# Altium schematic sheet Sheet1.SchDoc
size A1
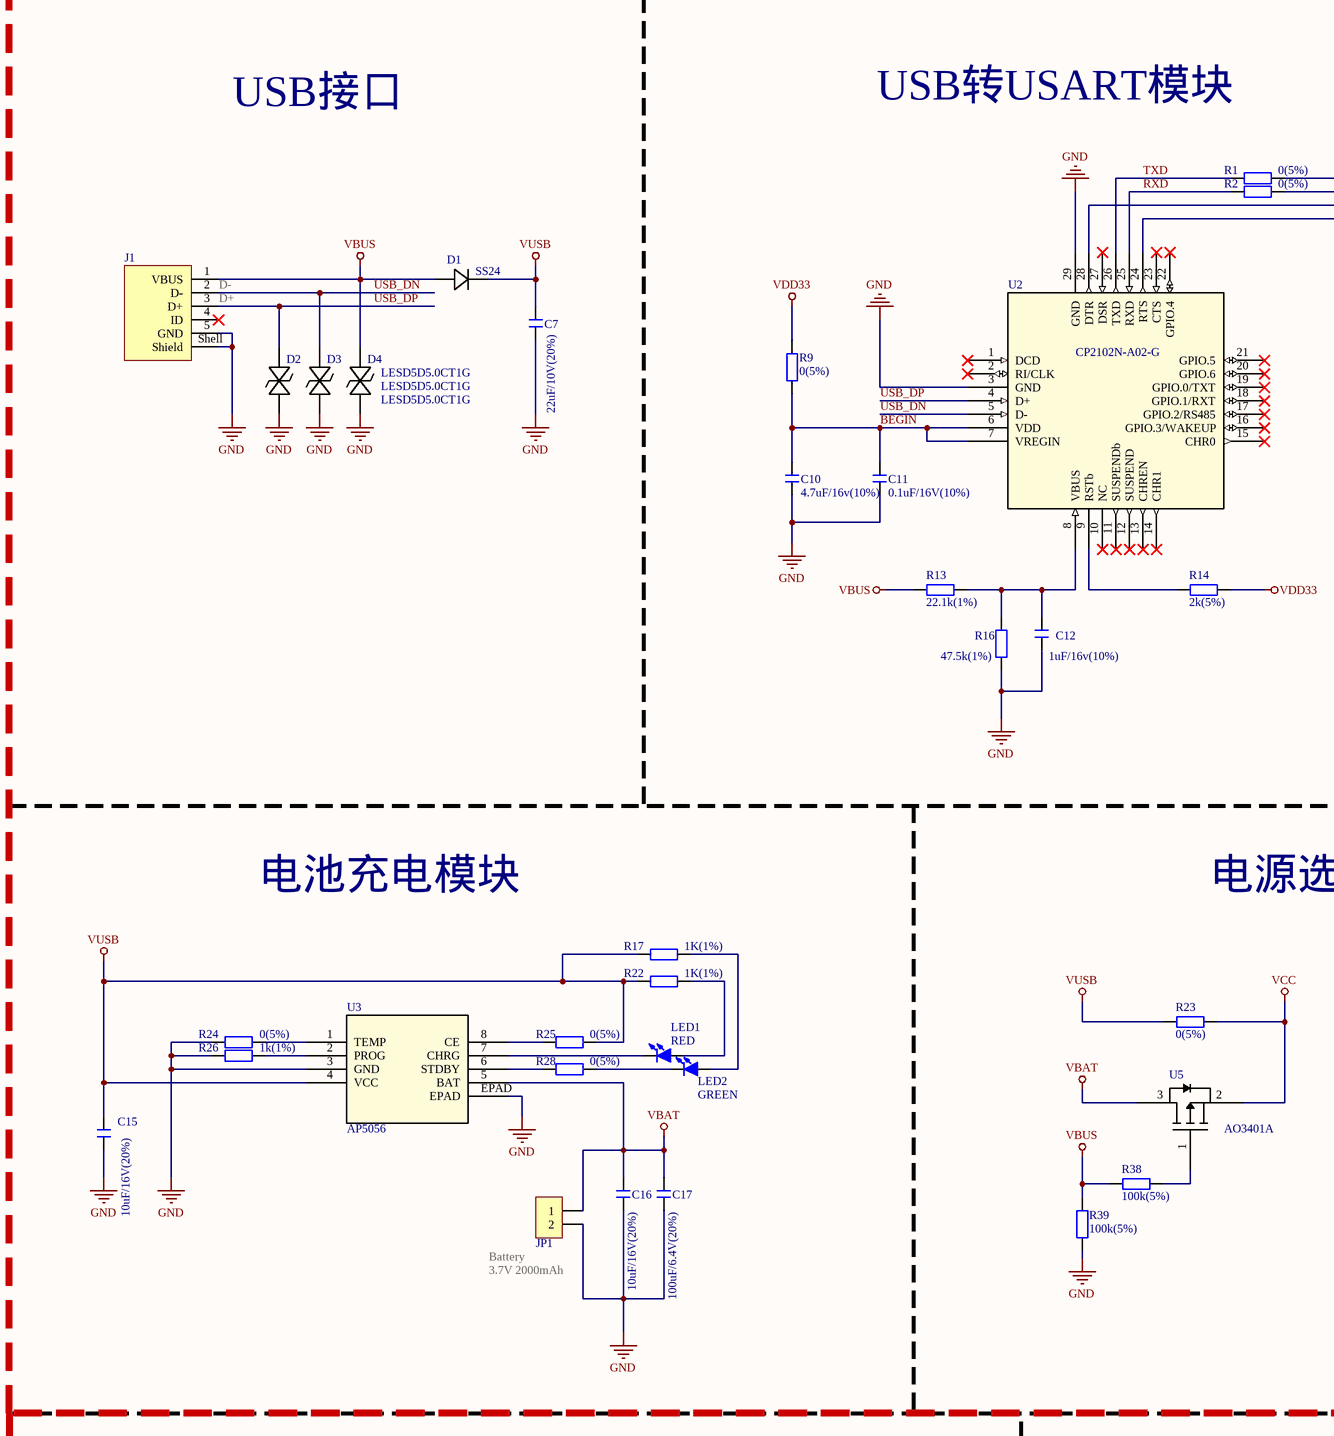
[diagram p0: Sheet1.SchDoc, top left]
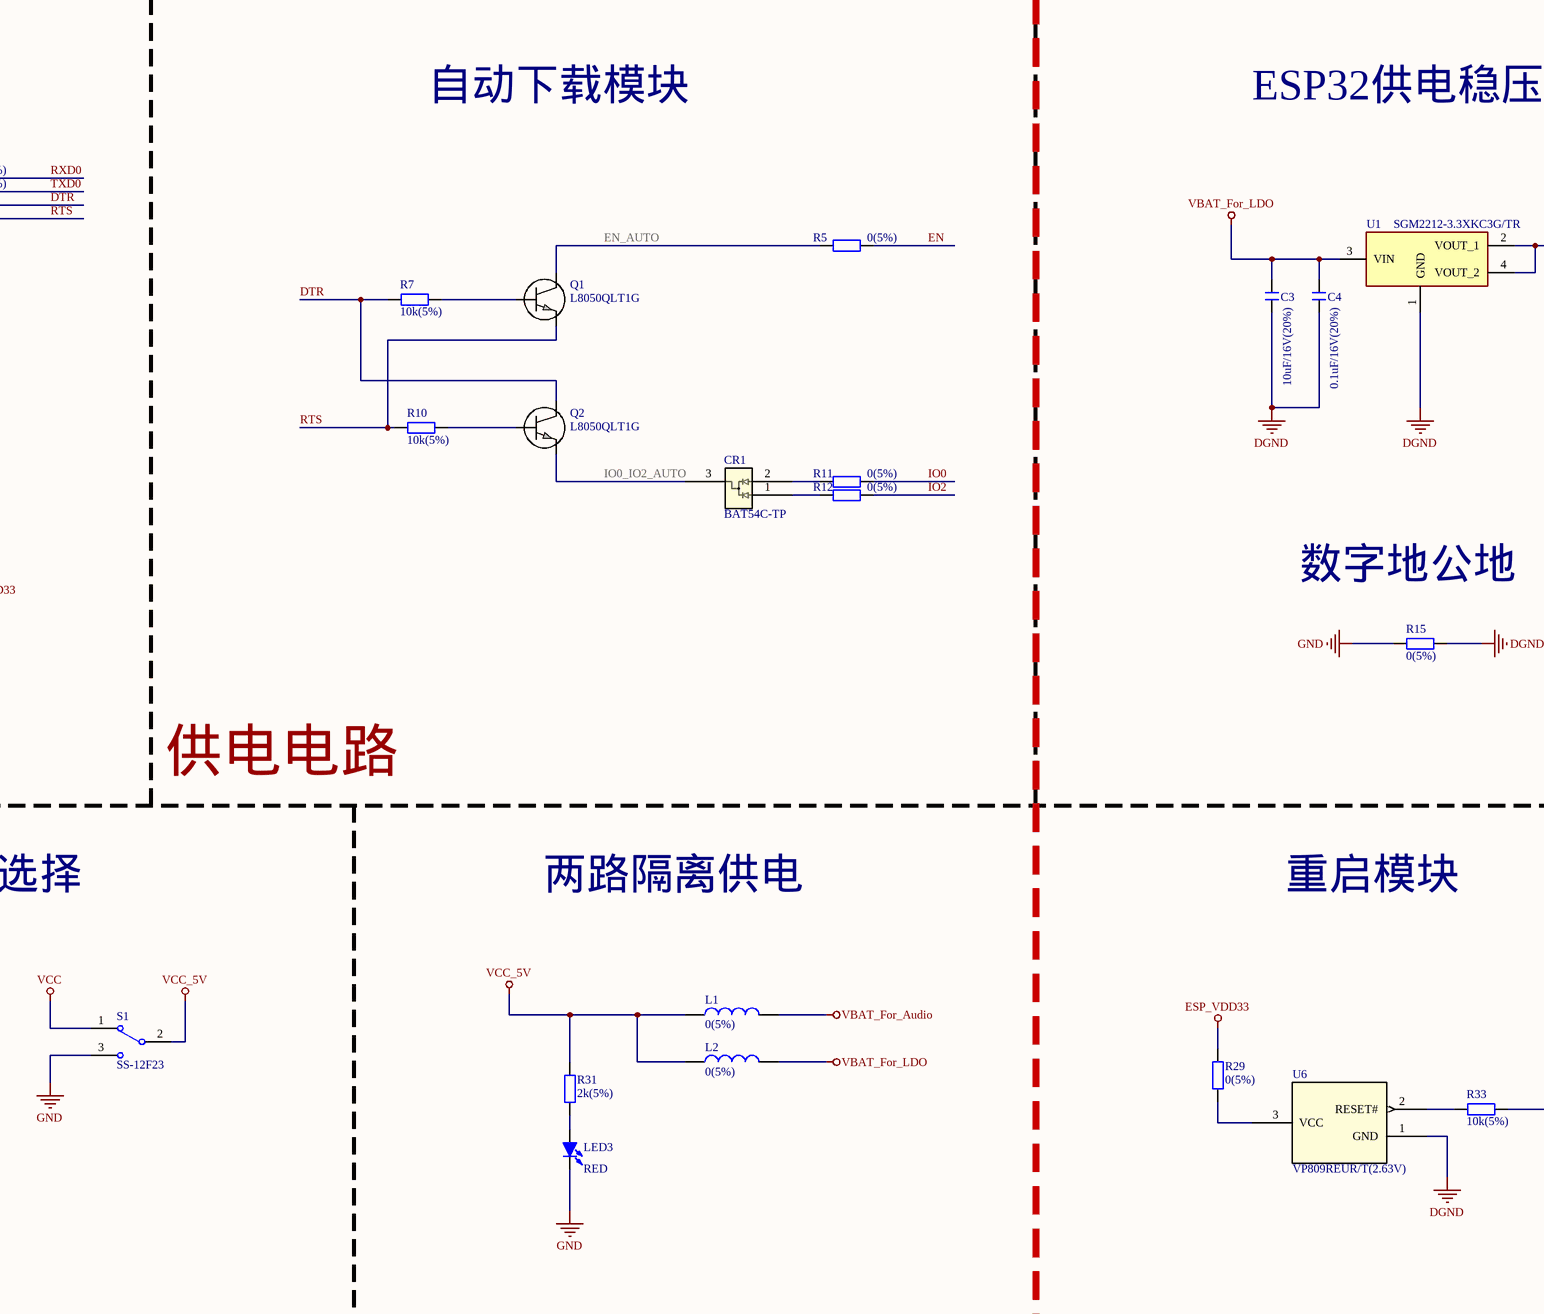
[diagram p1: Sheet1.SchDoc, top middle]
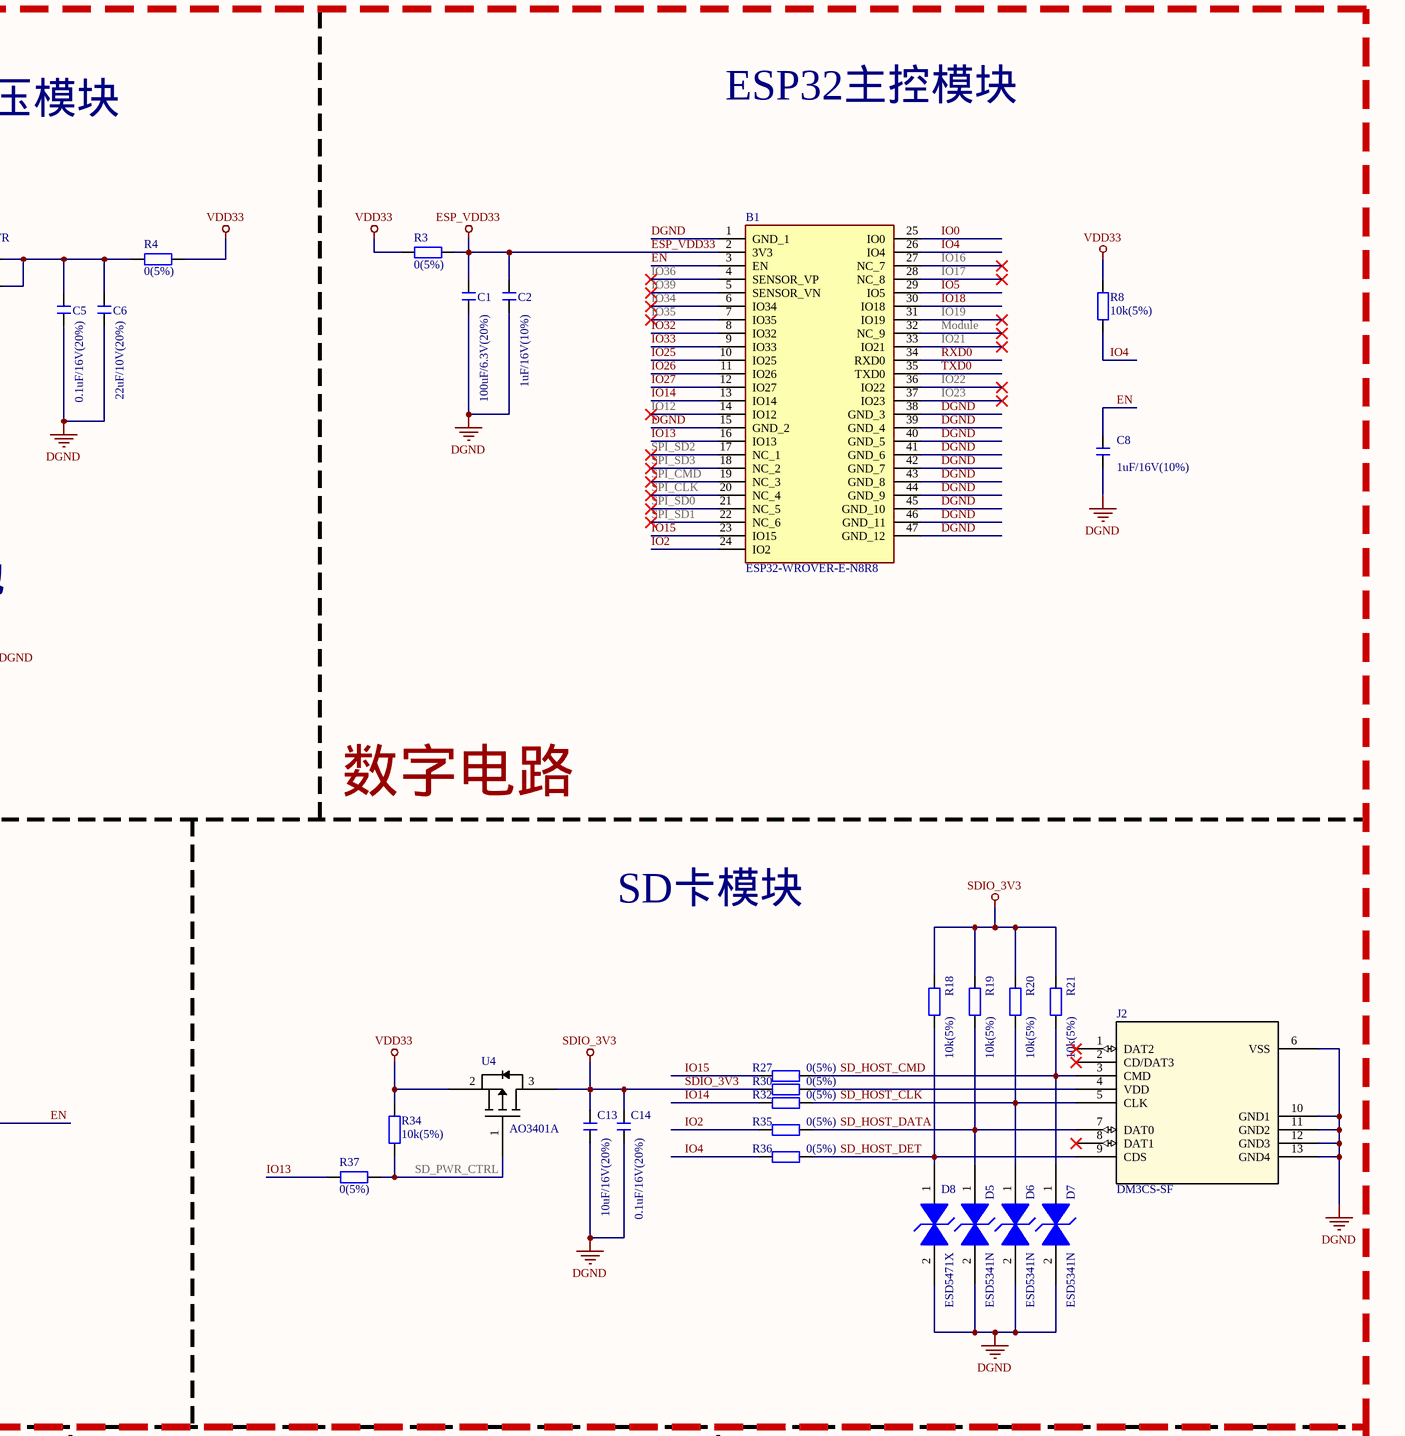
[diagram p2: Sheet1.SchDoc, top right]
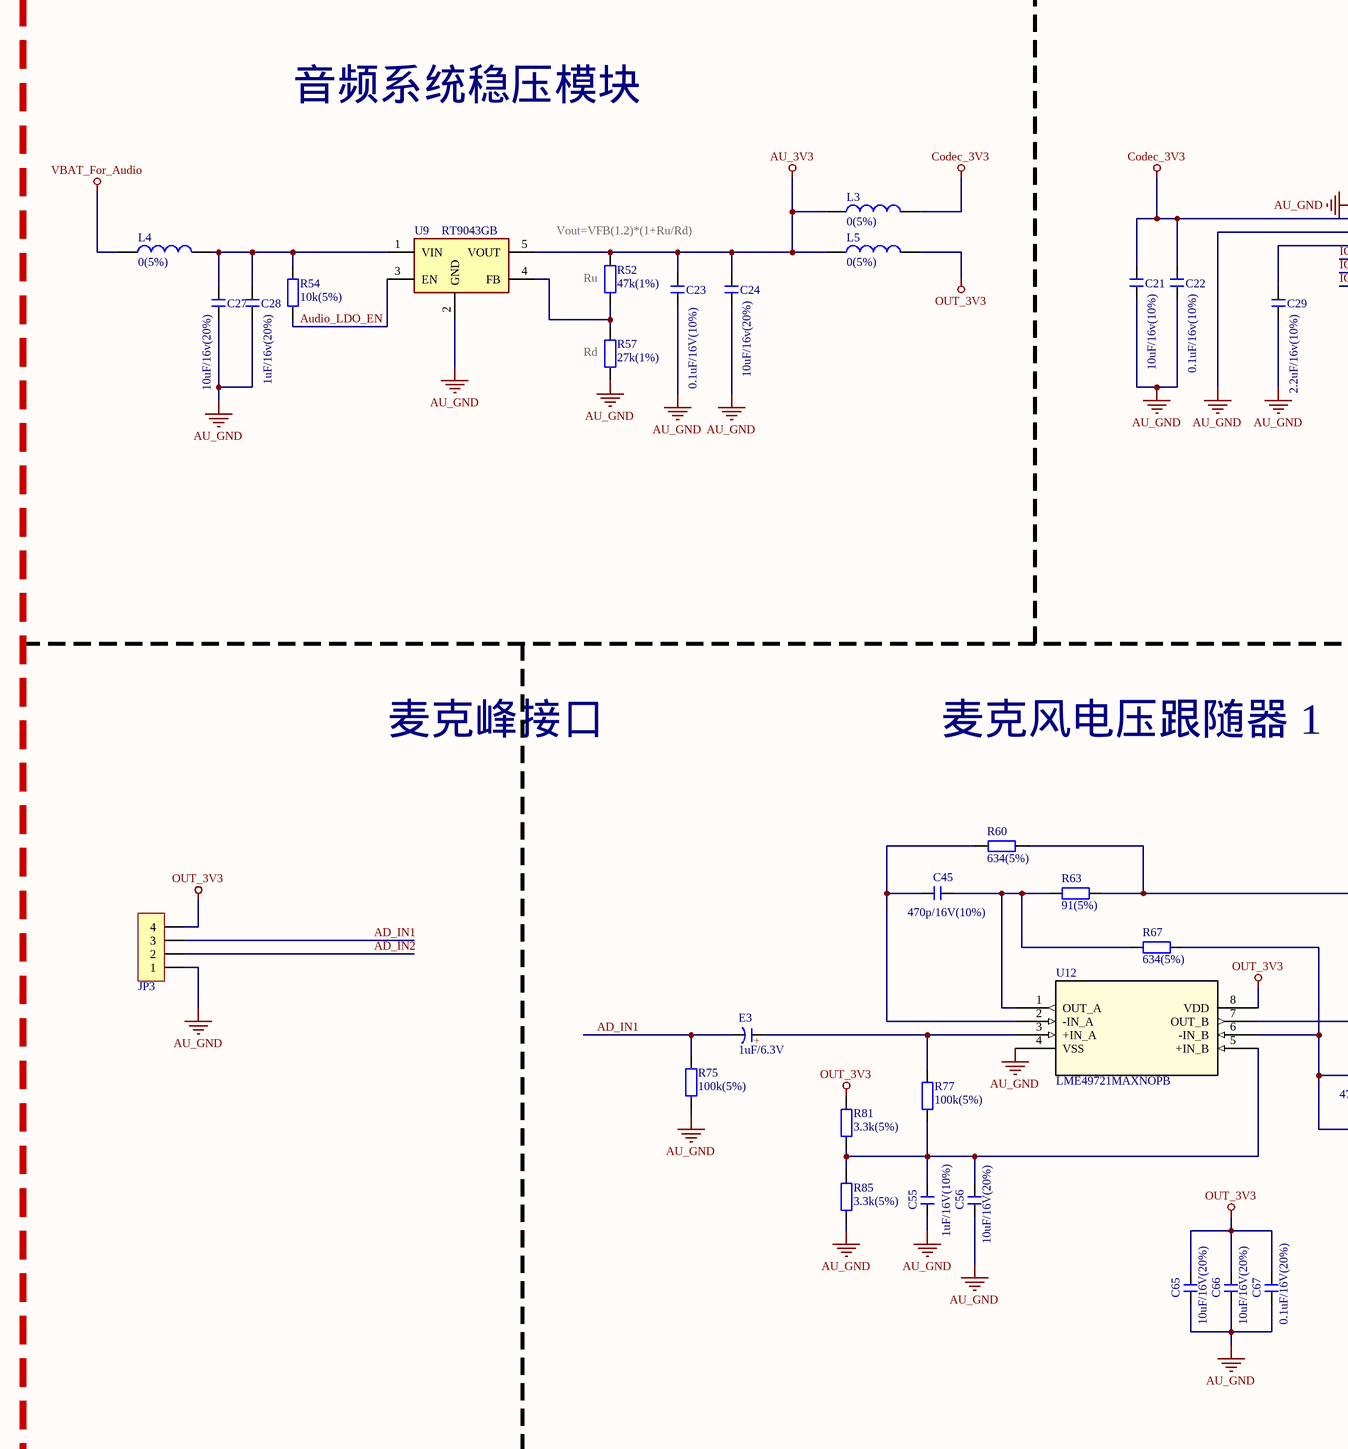
[diagram p3: Sheet1.SchDoc, bottom left]
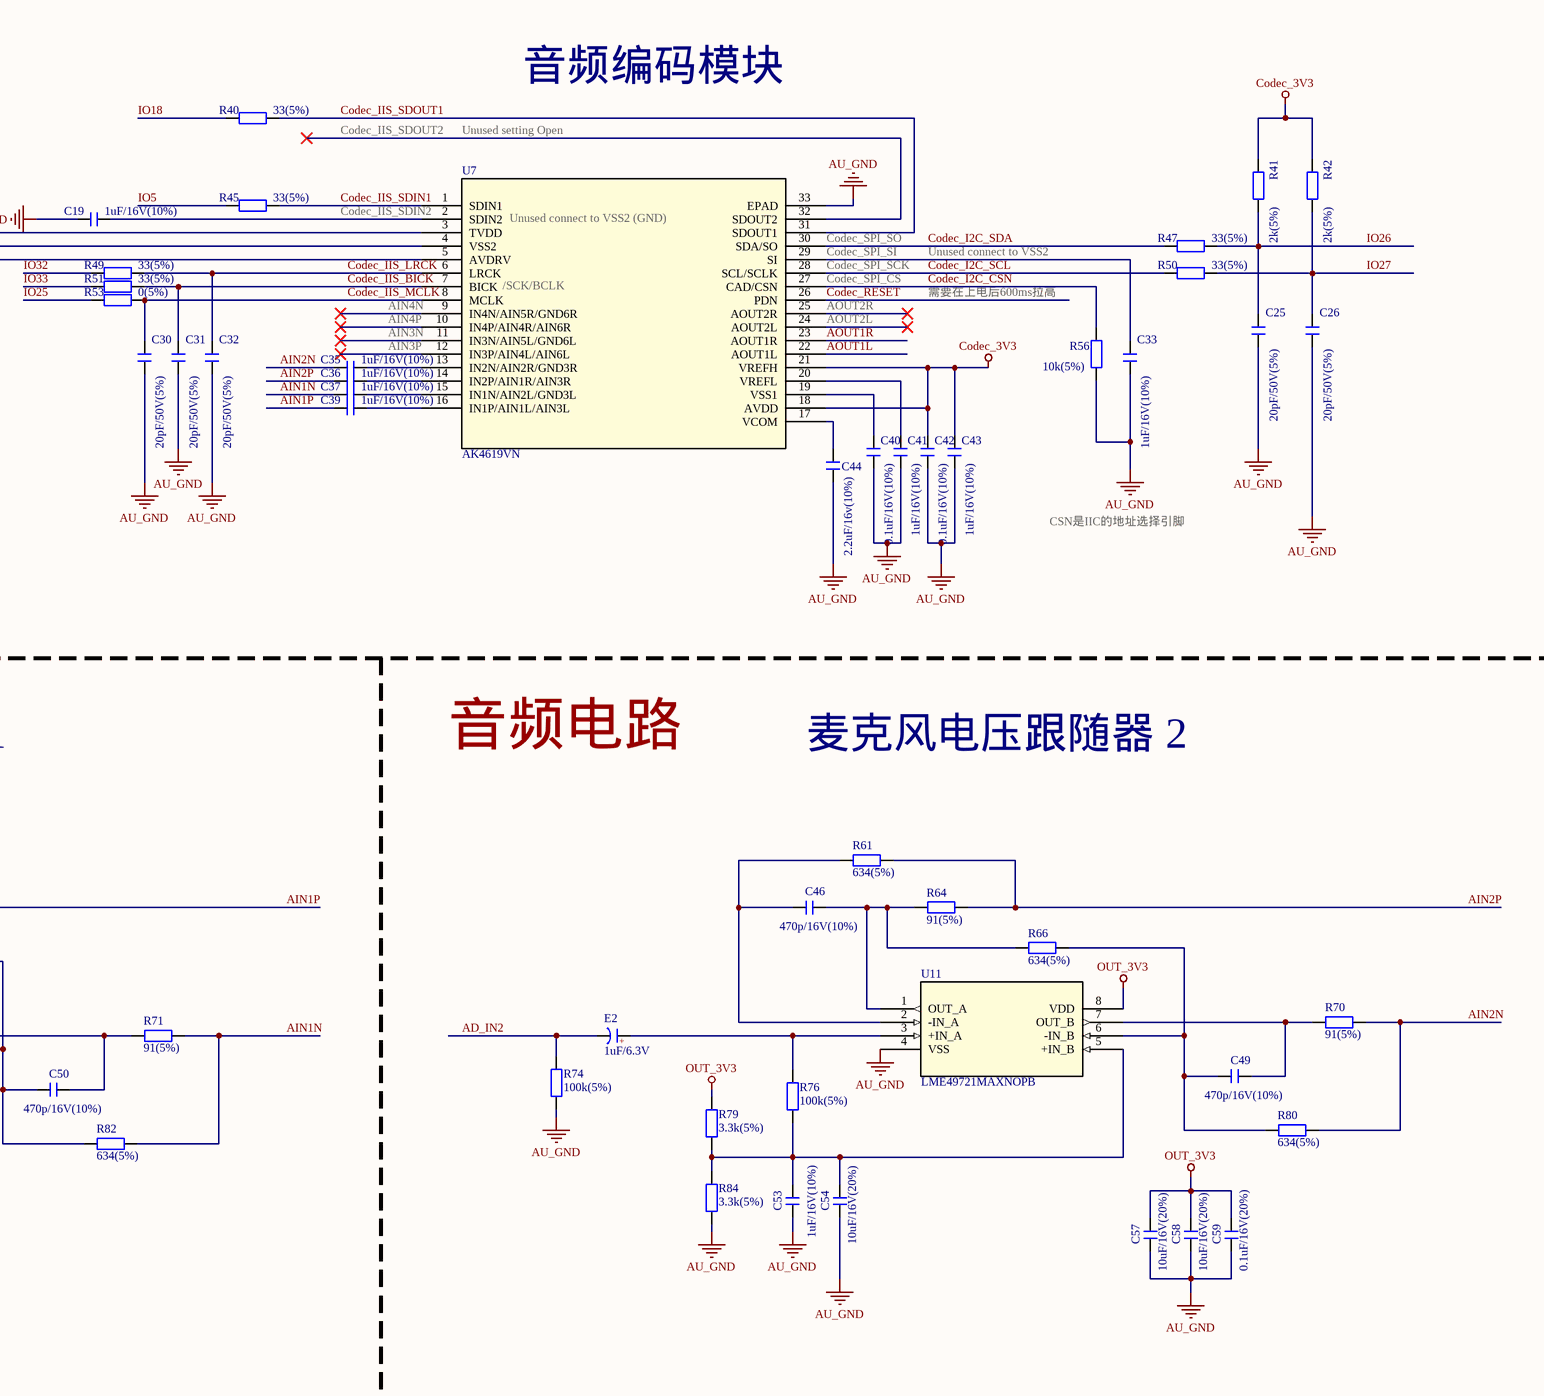
[diagram p4: Sheet1.SchDoc, bottom middle]
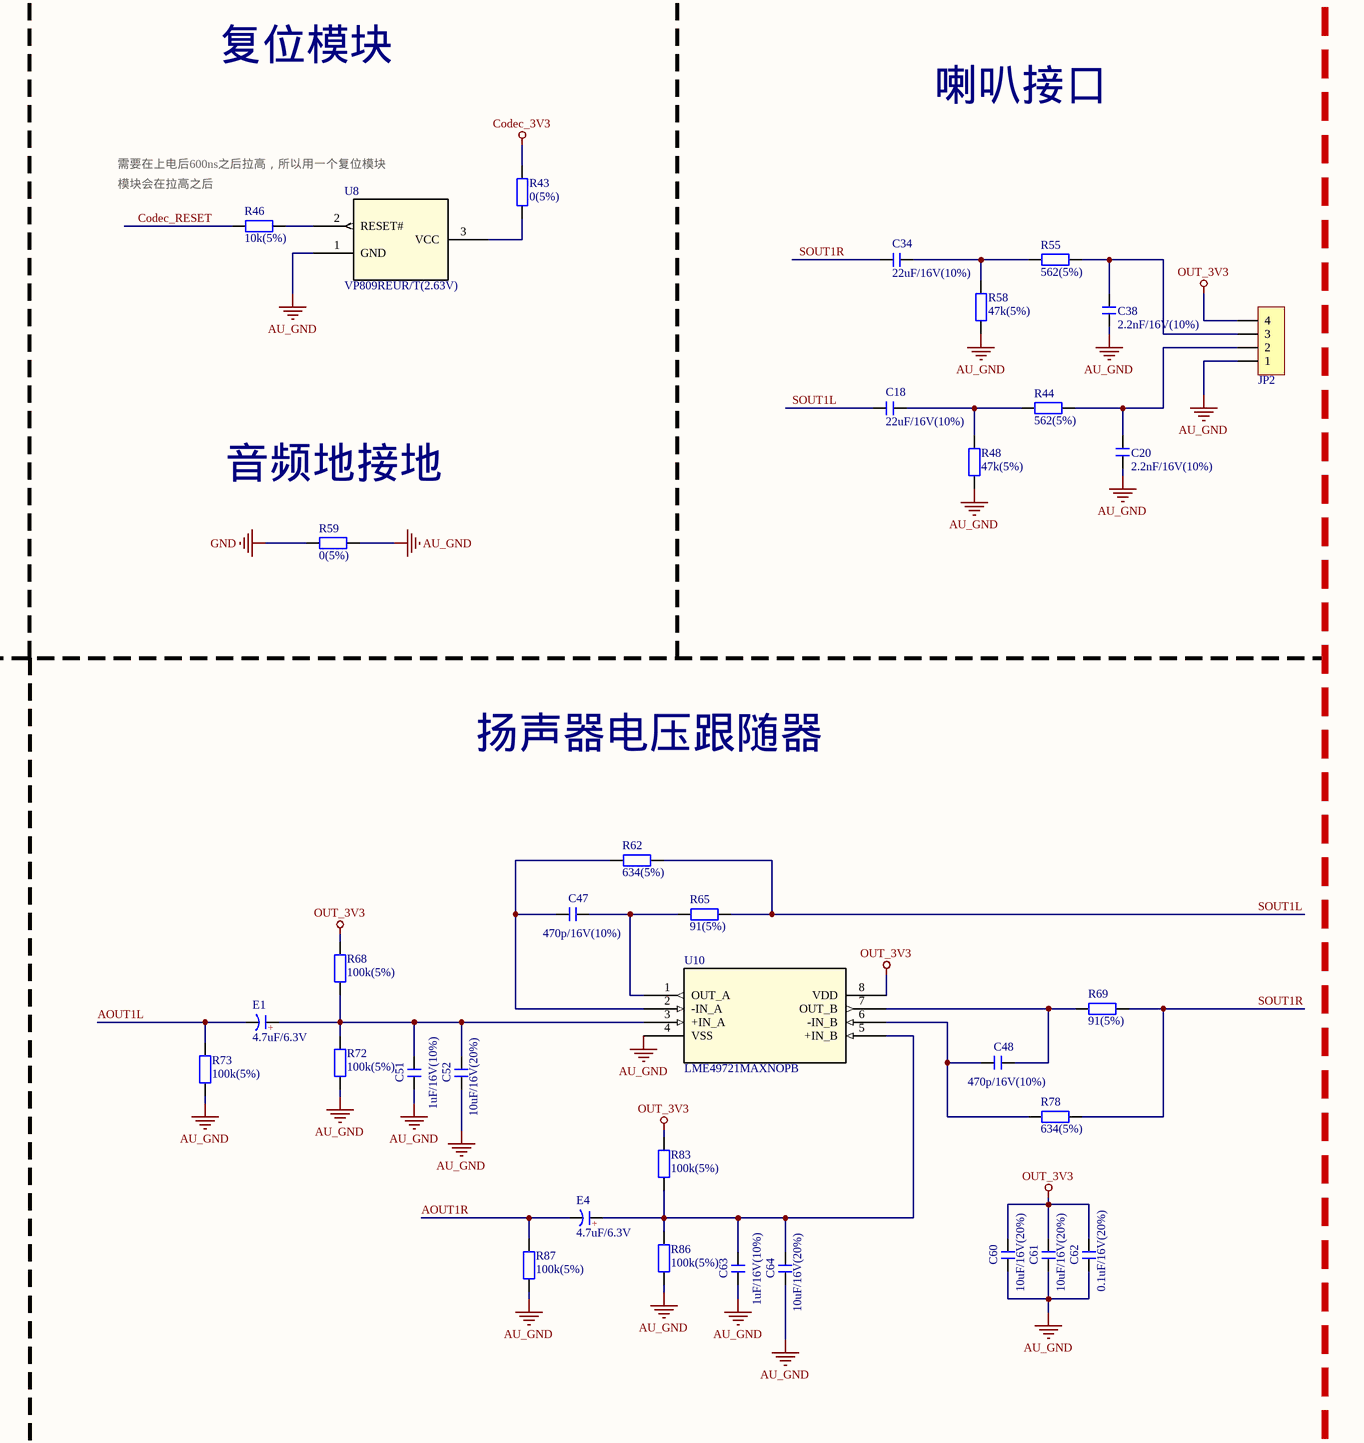
[diagram p5: Sheet1.SchDoc, bottom right]

## Parts
B1  ESP32-WROVER-E-N8R8  [ESP32WROVEREN8R8]
C1  100uF/6.3V(20%)  [C 1206]
C2  1uF/16V(10%)  [C 0402]
C3  10uF/16V(20%)  [C 0603]
C4  0.1uF/16V(20%)  [C 0402]
C5  0.1uF/16V(20%)  [C 0603]
C6  22uF/10V(20%)  [C 0805]
C7  22uF/10V(20%)  [C 0603]
C8  1uF/16V(10%)  [C 0402]
C10  4.7uF/16v(10%)  [C 0603]
C11  0.1uF/16V(10%)  [C 0402]
C12  1uF/16v(10%)  [C 0402]
C13  10uF/16V(20%)  [C 0603]
C14  0.1uF/16V(20%)  [C 0402]
C15  10uF/16V(20%)  [C 0603]
C16  10uF/16V(20%)  [C 0603]
C17  100uF/6.4V(20%)  [C 1206]
C18  22uF/16V(10%)  [C 0603]
C19  1uF/16V(10%)  [C 0402]
C20  2.2nF/16V(10%)  [C 0603]
C21  10uF/16v(10%)  [C 0603]
C22  0.1uF/16v(10%)  [C 0402]
C23  0.1uF/16V(10%)  [C 0402]
C24  10uF/16v(20%)  [C 0603]
C25  20pF/50V(5%)  [C 0402]
C26  20pF/50V(5%)  [C 0402]
C27  10uF/16v(20%)  [C 0603]
C28  1uF/16v(20%)  [C 0402]
C29  2.2uF/16v(10%)  [C 0603]
C30  20pF/50V(5%)  [C 0402]
C31  20pF/50V(5%)  [C 0402]
C32  20pF/50V(5%)  [C 0402]
C33  1uF/16V(10%)  [C 0402]
C34  22uF/16V(10%)  [C 0603]
C35  1uF/16V(10%)  [C 0402]
C36  1uF/16V(10%)  [C 0402]
C37  1uF/16V(10%)  [C 0402]
C38  2.2nF/16V(10%)  [C 0603]
C39  1uF/16V(10%)  [C 0402]
C40  0.1uF/16V(10%)  [C 0402]
C41  1uF/16V(10%)  [C 0402]
C42  0.1uF/16V(10%)  [C 0402]
C43  1uF/16V(10%)  [C 0402]
C44  2.2uF/16v(10%)  [C 0603]
C45  470p/16V(10%)  [C 0603]
C46  470p/16V(10%)  [C 0603]
C47  470p/16V(10%)  [C 0603]
C48  470p/16V(10%)  [C 0603]
C49  470p/16V(10%)  [C 0603]
C50  470p/16V(10%)  [C 0603]
C51  1uF/16V(10%)  [C 0603]
C52  10uF/16V(20%)  [C 0603]
C53  1uF/16V(10%)  [C 0603]
C54  10uF/16V(20%)  [C 0603]
C55  1uF/16V(10%)  [C 0603]
C56  10uF/16V(20%)  [C 0603]
C57  10uF/16V(20%)  [C 0603]
C58  10uF/16V(20%)  [C 0603]
C59  0.1uF/16V(20%)  [C 0603]
C60  10uF/16V(20%)  [C 0603]
C61  10uF/16V(20%)  [C 0603]
C62  0.1uF/16V(20%)  [C 0603]
C63  1uF/16V(10%)  [C 0603]
C64  10uF/16V(20%)  [C 0603]
C65  10uF/16V(20%)  [C 0603]
C66  10uF/16V(20%)  [C 0603]
C67  0.1uF/16V(20%)  [C 0603]
CR1  BAT54C-TP  [BAT54C-TP_MCE]
D1  SS24  [DIODE_DO214AA]
D2  LESD5D5.0CT1G  [CR_5.0CT1G_UMW]
D3  LESD5D5.0CT1G  [CR_5.0CT1G_UMW]
D4  LESD5D5.0CT1G  [CR_5.0CT1G_UMW]
D5  ESD5341N  [DFN1006-2_0402_TCP]
D6  ESD5341N  [DFN1006-2_0402_TCP]
D7  ESD5341N  [DFN1006-2_0402_TCP]
D8  ESD5471X  [DFN1006-2_0402_TCP]
E1  4.7uF/6.3V  [CD A(3216)]
E2  1uF/6.3V  [CD A(3216)]
E3  1uF/6.3V  [CD A(3216)]
E4  4.7uF/6.3V  [CD A(3216)]
J1  629105150521  [629105150521]  (value not drawn)
J2  DM3CS-SF  [DM3CS-SF_HIR]
JP1  HDR-1X2  [HDR-1X2]  (value not drawn)
JP2  HDR-1X4  [KF128-3.81-4P]  (value not drawn)
JP3  HDR-1X4  [KF128-3.81-4P]  (value not drawn)
L1  0(5%)  [L 0603]
L2  0(5%)  [L 0603]
L3  0(5%)  [L 0603]
L4  0(5%)  [L 0603]
L5  0(5%)  [L 0603]
LED1  RED  [LED 0603R]
LED2  GREEN  [LED 0603G]
LED3  RED  [LED 0603R]
Q1  L8050QLT1G  [SOT-23_LRC]
Q2  L8050QLT1G  [SOT-23_LRC]
R1  0(5%)  [R 0402]
R2  0(5%)  [R 0402]
R3  0(5%)  [R 0603]
R4  0(5%)  [R 0603]
R5  0(5%)  [R 0402]
R7  10k(5%)  [R 0402]
R8  10k(5%)  [R 0402]
R9  0(5%)  [R 0603]
R10  10k(5%)  [R 0402]
R11  0(5%)  [R 0402]
R12  0(5%)  [R 0402]
R13  22.1k(1%)  [R 0402]
R14  2k(5%)  [R 0402]
R15  0(5%)  [R 0805]
R16  47.5k(1%)  [R 0402]
R17  1K(1%)  [R 0402]
R18  10k(5%)  [R 0402]
R19  10k(5%)  [R 0402]
R20  10k(5%)  [R 0402]
R21  10k(5%)  [R 0402]
R22  1K(1%)  [R 0402]
R23  0(5%)  [R 0603]
R24  0(5%)  [R 0402]
R25  0(5%)  [R 0402]
R26  1k(1%)  [R 0402]
R27  0(5%)  [R 0402]
R28  0(5%)  [R 0402]
R29  0(5%)  [R 0402]
R30  0(5%)  [R 0402]
R31  2k(5%)  [R 0402]
R32  0(5%)  [R 0402]
R33  10k(5%)  [R 0402]
R34  10k(5%)  [R 0402]
R35  0(5%)  [R 0402]
R36  0(5%)  [R 0402]
R37  0(5%)  [R 0402]
R38  100k(5%)  [R 0402]
R39  100k(5%)  [R 0402]
R40  33(5%)  [R 0402]
R41  2k(5%)  [R 0402]
R42  2k(5%)  [R 0402]
R43  0(5%)  [R 0402]
R44  562(5%)  [R 0603]
R45  33(5%)  [R 0402]
R46  10k(5%)  [R 0402]
R47  33(5%)  [R 0402]
R48  47k(5%)  [R 0603]
R49  33(5%)  [R 0402]
R50  33(5%)  [R 0402]
R51  33(5%)  [R 0402]
R52  47k(1%)  [R 0402]
R53  0(5%)  [R 0402]
R54  10k(5%)  [R 0402]
R55  562(5%)  [R 0603]
R56  10k(5%)  [R 0402]
R57  27k(1%)  [R 0402]
R58  47k(5%)  [R 0603]
R59  0(5%)  [R 0805]
R60  634(5%)  [R 0603]
R61  634(5%)  [R 0603]
R62  634(5%)  [R 0603]
R63  91(5%)  [R 0603]
R64  91(5%)  [R 0603]
R65  91(5%)  [R 0603]
R66  634(5%)  [R 0603]
R67  634(5%)  [R 0603]
R68  100k(5%)  [R 0603]
R69  91(5%)  [R 0603]
R70  91(5%)  [R 0603]
R71  91(5%)  [R 0603]
R72  100k(5%)  [R 0603]
R73  100k(5%)  [R 0603]
R74  100k(5%)  [R 0603]
R75  100k(5%)  [R 0603]
R76  100k(5%)  [R 0603]
R77  100k(5%)  [R 0603]
R78  634(5%)  [R 0603]
R79  3.3k(5%)  [R 0603]
R80  634(5%)  [R 0603]
R81  3.3k(5%)  [R 0603]
R82  634(5%)  [R 0603]
R83  100k(5%)  [R 0603]
R84  3.3k(5%)  [R 0603]
R85  3.3k(5%)  [R 0603]
R86  100k(5%)  [R 0603]
R87  100k(5%)  [R 0603]
S1  SS-12F23  [MSK-12C01-07]
U1  SGM2212-3.3XKC3G/TR  [SOT230P700X180-4N]
U2  CP2102N-A02-G  [QFN28_5X5_SIL]
U3  AP5056  [IXYS_SOIC-8-EP_IXY]
U4  AO3401A  [SOT-23-3L_AOS]
U5  AO3401A  [SOT-23-3L_AOS]
U6  VP809REUR/T(2.63V)  [21-0051H_MXM]
U7  AK4619VN  [AK4619VN_AKM]
U8  VP809REUR/T(2.63V)  [21-0051H_MXM]
U9  RT9043GB  [SOT94P279X130-5N]
U10  LME49721MAXNOPB  [M08A]
U11  LME49721MAXNOPB  [M08A]
U12  LME49721MAXNOPB  [M08A]

## Nets
AU_3V3: C23.1 C24.1 L3.1 L5.1 R52.2 U9.5(VOUT)
AU_GND: C19.1 C20.1 C21.2 C22.2 C23.2 C24.2 C25.1 C26.2 C27.1 C28.1 C29.2 C30.1 C31.1 C32.1 C33.2 C38.1 C40.1 C41.1 C42.1 C43.1 C44.2 C51.1 C52.2 C53.1 C54.2 C55.1 C56.2 C57.2 C58.2 C59.2 C60.2 C61.2 C62.2 C63.1 C64.2 C65.2 C66.2 C67.2 JP2.1 JP3.1 R48.1 R56.1 R57.1 R58.1 R59.1 R72.1 R73.1 R74.1 R75.1 R84.1 R85.1 R86.1 R87.1 U7.4(VSS2) U7.33(EPAD) U8.1(GND) U9.2(GND) U10.4(VSS) U11.4(VSS) U12.4(VSS)
Codec_3V3: C21.1 C22.1 C42.2 C43.2 L3.2 R41.2 R42.2 R43.2 U7.3(TVDD) U7.18(AVDD) U7.21(VREFH)
DGND: B1.1(GND_1) B1.15(GND_2) B1.38(GND_3) B1.39(GND_4) B1.40(GND_5) B1.41(GND_6) B1.42(GND_7) B1.43(GND_8) B1.44(GND_9) B1.45(GND_10) B1.46(GND_11) B1.47(GND_12) C1.1 C2.2 C3.1 C4.1 C5.1 C6.1 C8.2 C13.1 C14.1 D5.2(GND) D6.2(GND) D7.2(GND) D8.2(GND) J2.6(VSS) J2.10(GND1) J2.11(GND2) J2.12(GND3) J2.13(GND4) R15.1 U1.1(GND) U6.1(GND)
ESP_VDD33: B1.2(3V3) C1.2 C2.1 R3.2 R29.2
GND: C7.1 C10.1 C11.2 C12.1 C15.1 C16.1 C17.2 D2.1 D3.2 D4.1 J1.5(GND) J1.Shell(Shield) JP1.2 LED3.2(K) R15.2 R16.1 R24.1 R26.1 R39.1 R59.2 S1.3 U2.3(GND) U2.29(GND) U3.3(GND) U3.EPAD
OUT_3V3: C57.1 C58.1 C59.1 C60.1 C61.1 C62.1 C65.1 C66.1 C67.1 JP2.4 JP3.4 L5.2 R68.1 R79.1 R81.1 R83.1 U10.8(VDD) U11.8(VDD) U12.8(VDD)
SDIO_3V3: C13.2 C14.2 R18.2 R19.2 R20.2 R21.2 R30.2 U4.3(D)
VBAT: C16.2 C17.1 JP1.1 U3.5(BAT) U5.3(D)
VBAT_For_Audio: L1.2 L4.1
VBAT_For_LDO: C3.2 C4.2 L2.2 U1.3(VIN)
VBUS: D1.2 D4.2 J1.1(VBUS) R13.1 R38.1 R39.2
VCC: R23.2 S1.1 U5.2(S)
VCC_5V: L1.1 L2.1 R31.2 S1.2
VDD33: R3.1 R4.2 R8.2 R9.2 R14.1 R34.2 U4.2(S)
VUSB: C7.2 C15.2 D1.1 R17.1 R22.1 R23.1 R25.2 U3.4(VCC)
AD_IN1: E3.2(K) JP3.3 R75.2
AD_IN2: E2.2(K) JP3.2 R74.2
AIN1N: C37.2 R71.1 R82.1
AIN1P: C39.2 R60.1 R63.1
AIN2N: C35.2 R70.1 R80.1
AIN2P: C36.2 R61.1 R64.1
AOUT1L: E1.2(K) R73.2 U7.22(AOUT1L)
AOUT1R: E4.2(K) R87.2 U7.23(AOUT1R)
Audio_LDO_EN: R54.1 U9.3(EN)
BEGIN: C10.2 C11.1 R9.1 U2.6(VDD) U2.7(VREGIN)
Codec_I2C_CSN: R56.2 U7.27(CAD/CSN)
Codec_I2C_SCL: R50.1 U7.28(SCL/SCLK)
Codec_I2C_SDA: R47.1 U7.30(SDA/SO)
Codec_IIS_BICK: C31.2 R51.2 U7.7(BICK)
Codec_IIS_LRCK: C32.2 R49.2 U7.6(LRCK)
Codec_IIS_MCLK: C30.2 R53.2 U7.8(MCLK)
Codec_IIS_SDIN1: R45.2 U7.1(SDIN1)
Codec_IIS_SDOUT1: R40.2 U7.31(SDOUT1)
Codec_RESET: R46.1 U7.26(PDN)
DTR: Q2.3 R7.1 U2.28(DTR)
EN: B1.3(EN) C8.1 R5.2 R33.1
IO0: B1.25(IO0) R11.2
IO2: B1.24(IO2) R12.2 R35.2
IO4: B1.26(IO4) R8.1 R36.2
IO5: B1.29(IO5) R45.1
IO13: B1.16(IO13) R37.2
IO14: B1.13(IO14) R32.2
IO15: B1.23(IO15) R27.2
IO18: B1.30(IO18) R40.1
IO25: B1.10(IO25) R53.1
IO26: B1.11(IO26) C25.2 R41.1 R47.2
IO27: B1.12(IO27) C26.1 R42.1 R50.2
IO32: B1.8(IO32) R49.1
IO33: B1.9(IO33) R51.1
RTS: Q1.2 R10.1 U2.24(RTS)
RXD: R2.1 U2.25(RXD)
RXD0: B1.34(RXD0) R1.2
SD_HOST_CLK: D6.1(I/O) J2.5(CLK) R20.1 R32.1
SD_HOST_CMD: D7.1(I/O) J2.3(CMD) R21.1 R27.1
SD_HOST_DATA: D5.1(I/O) J2.7(DAT0) R19.1 R35.1
SD_HOST_DET: D8.1(I/O) J2.9(CDS) R18.1 R36.1
SOUT1L: C18.1 R62.1 R65.1
SOUT1R: C34.1 R69.1 R78.1
TXD: R1.1 U2.26(TXD)
TXD0: B1.35(TXD0) R2.2
USB_DN: D3.1 J1.2(D-) U2.5(D-)
USB_DP: D2.2 J1.3(D+) U2.4(D+)
NetC5_2: C5.2 C6.2 R4.1 U1.2(VOUT_1) U1.4(VOUT_2)
NetC12_2: C12.2 R13.2 R16.2 U2.8(VBUS)
NetC18_2: C18.2 R44.1 R48.2
NetC19_2: C19.2 U7.2(SDIN2)
NetC20_2: C20.2 JP2.2 R44.2
NetC27_2: C27.2 C28.2 L4.2 R54.2 U9.1(VIN)
NetC29_1: C29.1 U7.5(AVDRV)
NetC33_1: C33.1 U7.29(SI)
NetC34_2: C34.2 R55.1 R58.2
NetC35_1: C35.1 U7.13(IN2N/AIN2R/GND3R)
NetC36_1: C36.1 U7.14(IN2P/AIN1R/AIN3R)
NetC37_1: C37.1 U7.15(IN1N/AIN2L/GND3L)
NetC38_2: C38.2 JP2.3 R55.2
NetC39_1: C39.1 U7.16(IN1P/AIN1L/AIN3L)
NetC40_2: C40.2 U7.19(VSS1)
NetC41_2: C41.2 U7.20(VREFL)
NetC44_1: C44.1 U7.17(VCOM)
NetC45_1: C45.1 R63.2 R67.1 U12.1(OUT_A)
NetC45_2: C45.2 R60.2 U12.2(-IN_A)
NetC46_1: C46.1 R64.2 R66.1 U11.1(OUT_A)
NetC46_2: C46.2 R61.2 U11.2(-IN_A)
NetC47_1: C47.1 R65.2 U10.1(OUT_A)
NetC47_2: C47.2 R62.2 U10.2(-IN_A)
NetC48_1: C48.1 R69.2 U10.7(OUT_B)
NetC48_2: C48.2 R78.2 U10.6(-IN_B)
NetC49_1: C49.1 R70.2 U11.7(OUT_B)
NetC49_2: C49.2 R66.2 R80.2 U11.6(-IN_B)
NetC50_1: C50.1 R71.2 U12.7(OUT_B)
NetC50_2: C50.2 R67.2 R82.2 U12.6(-IN_B)
NetC51_2: C51.2 C52.1 E1.1(A) R68.2 R72.2 U10.3(+IN_A)
NetC53_2: C53.2 C54.1 R76.1 R79.2 R84.2 U11.5(+IN_B)
NetC55_2: C55.2 C56.1 R77.1 R81.2 R85.2 U12.5(+IN_B)
NetC63_2: C63.2 C64.1 E4.1(A) R83.2 R86.2 U10.5(+IN_B)
NetCR1_1: CR1.1 R12.1
NetCR1_2: CR1.2 R11.1
NetCR1_3: CR1.3 Q2.2
NetE2_1: E2.1(A) R76.2 U11.3(+IN_A)
NetE3_1: E3.1(A) R77.2 U12.3(+IN_A)
NetJ2_4: J2.4(VDD) R30.1
NetLED1_1: LED1.1(A) R22.2
NetLED1_2: LED1.2(K) U3.7(CHRG)
NetLED2_1: LED2.1(A) R17.2
NetLED2_2: LED2.2(K) R28.2
NetLED3_1: LED3.1(A) R31.1
NetQ1_1: Q1.1 R7.2
NetQ1_3: Q1.3 R5.1
NetQ2_1: Q2.1 R10.2
NetR14_2: R14.2 U2.9(RSTb)
NetR24_2: R24.2 U3.1(TEMP)
NetR25_1: R25.1 U3.8(CE)
NetR26_2: R26.2 U3.2(PROG)
NetR28_1: R28.1 U3.6(STDBY)
NetR29_1: R29.1 U6.3(VCC)
NetR33_2: R33.2 U6.2(RESET#)
NetR34_1: R34.1 R37.1 U4.1(G)
NetR38_2: R38.2 U5.1(G)
NetR43_1: R43.1 U8.3(VCC)
NetR46_2: R46.2 U8.2(RESET#)
NetR52_1: R52.1 R57.2 U9.4(FB)

Not connected (* = marked no-connect by the designer): B1 4(SENSOR_VP)* 5(SENSOR_VN)* 6(IO34)* 7(IO35)* 14(IO12)* 17(NC_1)* 18(NC_2)* 19(NC_3)* 20(NC_4)* 21(NC_5)* 22(NC_6)* 27(NC_7)* 28(NC_8)* 31(IO19)* 32(NC_9)* 33(IO21)* 36(IO22)* 37(IO23)*; J1 4(ID)*; J2 1(DAT2)* 2(CD/DAT3)* 8(DAT1)*; U2 1(DCD)* 2(RI/CLK)* 10(NC)* 11(SUSPENDb)* 12(SUSPEND)* 13(CHREN)* 14(CHR1)* 15(CHR0)* 16(GPIO.3/WAKEUP)* 17(GPIO.2/RS485)* 18(GPIO.1/RXT)* 19(GPIO.0/TXT)* 20(GPIO.6)* 21(GPIO.5)* 22(GPIO.4)* 23(CTS)* 27(DSR)*; U7 9(IN4N/AIN5R/GND6R)* 10(IN4P/AIN4R/AIN6R)* 11(IN3N/AIN5L/GND6L)* 12(IN3P/AIN4L/AIN6L)* 24(AOUT2L)* 25(AOUT2R)* 32(SDOUT2)*

## Notes on the sheet
- USB接口
- USB转USART模块
- 自动下载模块
- ESP32供电稳压模块
- ESP32主控模块
- (near J1) D-
- EN_AUTO
- IO36
- IO39
- IO34
- (near B1) IO16
- (near B1) IO17
- (near J1) D+
- IO35
- (near B1) Module
- (near B1) IO19
- (near B1) IO21
- IO12
- (near B1) IO22
- (near B1) IO23
- IO0_IO2_AUTO
- (near B1) SPI_SD2
- (near B1) SPI_SD3
- (near B1) SPI_CMD
- (near B1) SPI_CLK
- (near B1) SPI_SD0
- (near B1) SPI_SD1
- 数字地公地
- 供电电路
- 数字电路
- 电池充电模块
- 电源选择
- 两路隔离供电
- 重启模块
- SD卡模块
- (near R34) SD_PWR_CTRL
- (near JP1) Battery
- (near JP1) 3.7V 2000mAh
- 复位模块
- 音频系统稳压模块
- 音频编码模块
- 喇叭接口
- Codec_IIS_SDOUT2
- Unused setting Open
- 需要在上电后600ns之后拉高，所以用一个复位模块
- 模块会在拉高之后
- (near R52) Vout=VFB(1.2)*(1+Ru/Rd)
- (near U7) Codec_IIS_SDIN2
- (near U7) Unused connect to VSS2 (GND)
- (near U7) Codec_SPI_SO
- (near U7) Codec_SPI_SI
- Unused connect to VSS2
- (near R52) Ru
- AIN4N
- AIN4P
- AIN3N
- (near U7) /SCK/BCLK
- (near U7) AOUT2R
- (near U7) AOUT2L
- (near U7) Codec_SPI_SCK
- (near U7) Codec_SPI_CS
- 需要在上电后600ms拉高
- (near R57) Rd
- AIN3P
- CSN是IIC的地址选择引脚
- 音频地接地
- 麦克峰接口
- 麦克风电压跟随器 1
- 音频电路
- 麦克风电压跟随器 2
- 扬声器电压跟随器
- (in symbol C-CD) +

## Library data of the parts
B1 = ESP32-WROVER-E-N8R8: Multiprotocol Modules SMD Module ESP32-WROVER-E, ESP32-D0WD-V3, 3.3V 64Mbit PSRAM, 8 MB SPI flash, PCB Antenna; Manufacturer_Name: Espressif Systems; Geometry.Height: 3.45mm; Mouser Part Number: 356-ESP32WRVE26464PC; Mouser Price/Stock: https://www.mouser.co.uk/ProductDetail/Espressif-Systems/ESP32-WROVER-E-N8R8?qs=Li%252BoUPsLEnv2mctFVAGY3g%3D%3D; Manufacturer_Part_Number: ESP32-WROVER-E-N8R8; Datasheet Link: https://www.espressif.com/sites/default/files/documentation/esp32-wrover-e_esp32-wrover-ie_datasheet_en.pdf
C1-C8 C10-C67 = C: 无极性贴片电容; 版权归属: 源创客; BOM名称: 无极性贴片电容; 学习资源: www.ooocke.com
CR1 = BAT54C-TP: No Description Available; Mfr_Name: MCC; RefDes: RefDes; Type: Type
D1 = SS24-E352T: No Description Available; Mfr_Name: Vishay
D2-D4 = LESD5D5.0CT1G: No Description Available; Mfr_Name: UMW(Youtai Semiconductor Co., Ltd.); Type: Current Regulation - Diodes, Transistors
D5-D7 = ESD5341N: No Description Available; Mfr_Name: Tech Public; RefDes: RefDes; Type: Type
D8 = ESD5471X: No Description Available; Mfr_Name: Tech Public; RefDes: RefDes; Type: Type
E1-E4 = C-CD: 贴片钽电容; 版权归属: 源创客; BOM名称: 贴片钽电容; 学习资源: www.ooocke.com
J1 = 629105150521: WR-COM Micro USB 2.0 SMT Type B Horizontal 5 Contacts High Current; Manufacturer: Wurth Elektronik; Match Code: WR-USB; Gender: Receptacle; Interface Type: Type B; Number of Ports: 1; Rated Current: 3A; Working Voltage: 30V (AC); Manufacturer Part Number: 629105150521; Category: Input/Output Connectors; ComponentLink1Description: Website Link; ComponentLink1URL: https://www.we-online.com/redexpert/article/629105150521?ad; ComponentLink2Description: Datasheet Link; ComponentLink2URL: https://www.we-online.com/redexpert/spec/629105150521?ad; Mount: Surface Mount; Operating Temperature Max: 85°C; Operating Temperature Min: -40°C; Packaging: Tape and Reel; Application: Micro USB 2.0; Number of Pins: 5; Orientation: Horizontal
J2 = DM3CS-SF: No Description Available; Mfr_Name: Hirose; RefDes: RefDes; Type: Type
JP1 = Header 2: 2P接插件; 版权归属: 源创客; BOM名称: 2P接插件; 学习资源: www.ooocke.com
JP2 JP3 = Header 4: 4P接插件; 版权归属: 源创客; BOM名称: 4P接插件; 学习资源: www.ooocke.com
L1-L5 = L: 小功率贴片电感; 版权归属: 源创客; BOM名称: 小功率贴片电感; 学习资源: www.ooocke.com
LED1-LED3 = LED-SMD: 贴片LED; 版权归属: 源创客; BOM名称: 贴片LED; 学习资源: www.ooocke.com
Q1 Q2 = L8050QLT1G: No Description Available; Mfr_Name: Leshan Radio Co.
R1-R5 R7-R87 = R: 贴片电阻; 版权归属: 源创客; BOM名称: 贴片电阻; 学习资源: www.ooocke.com
S1 = SSW-1P: 1路波动开关; BOM名称: 波动开关; 版权归属: 源创客; 学习资源: www.ooocke.com
U1 = SGM2212-3.3XKC3G_TR: SOT-223-3; Manufacturer_Name: Silicon Labs; Geometry.Height: 1.8mm; Manufacturer_Part_Number: SGM2212-3.3XKC3G/TR; Mouser Part Number: *; Mouser Price/Stock: *; Arrow Part Number: *; Arrow Price/Stock: *; Datasheet Link: http://cn.sg-micro.com/uploads/soft/20220506/1651835177.pdf
U2 = CP2102N-A02-GQFN28: No Description Available; Mfr_Name: Silicon Labs; RefDes: RefDes; Type: Type
U3 = AP5056: No Description Available; Mfr_Name: Littelfuse Inc; RefDes: RefDes; Type: Type
U4 U5 = AO3401A: No Description Available; Mfr_Name: Alpha and Omega Semiconductor; RefDes: RefDes; Type: Type
U6 U8 = VP809REUR/T: No Description Available; Mfr_Name: Analog Devices Inc; RefDes: RefDes; Type: Type
U7 = AK4619VN: No Description Available; Mfr_Name: AKM; RefDes: RefDes; Type: Type
U9 = RT9043GB: LDO Voltage Regulators High PSRR, Low Dropout, 400mA Adjustable LDO Regulator; Manufacturer_Name: RICHTEK; Geometry.Height: 1.295mm; Mouser Part Number: 835-RT9043GB; Mouser Price/Stock: https://www.mouser.co.uk/ProductDetail/Richtek/RT9043GB?qs=amGC7iS6iy9PfV5OBggxlg%3D%3D; Manufacturer_Part_Number: RT9043GB; Datasheet Link: https://componentsearchengine.com/Datasheets/2/RT9043GB.pdf
U10-U12 = LME49721MAXNOPB: No Description Available; Mfr_Name: Texas Instruments; RefDes: RefDes; Type: Type